# EAGLE design ATTINY85flasher (EAGLE 9.5.0)
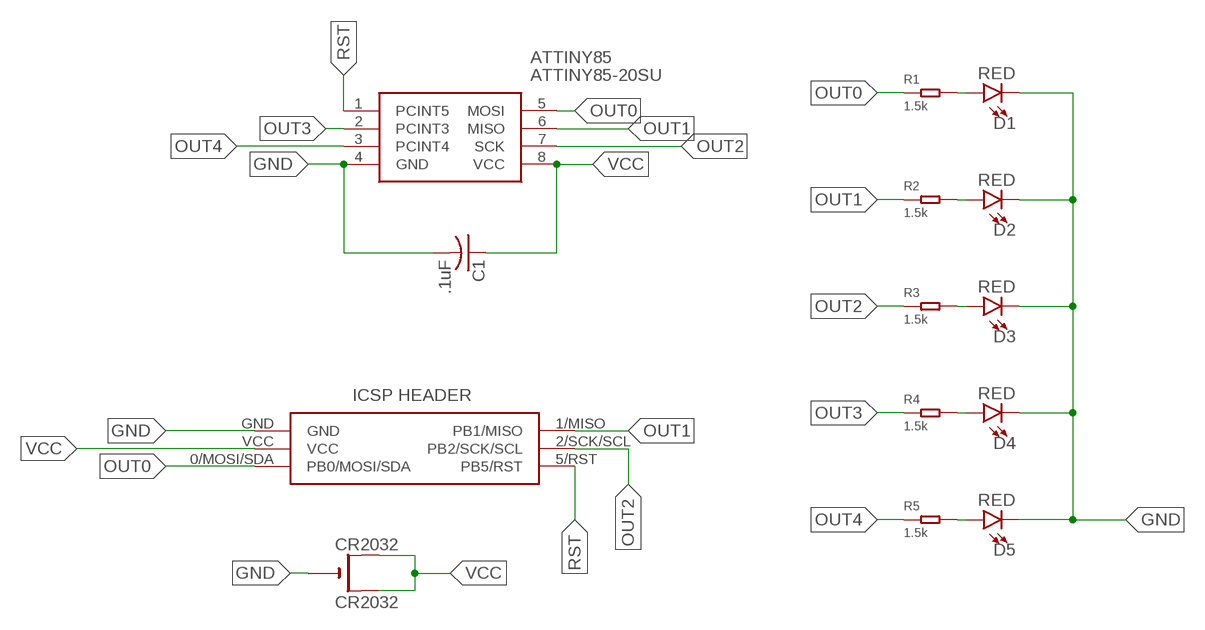
[diagram p0: schematic, sheet 1]

## Parts
ATTINY85  ATTINY85-20SU  [SOT127P798X216-8N]
C1  .1uF  C-USC0603  [C0603]
CR2032  CR2032  CR2032SMT  [CR2032-SMD]
D1  RED  LED-RED1206  [LED-1206]
D2  RED  LED-RED1206  [LED-1206]
D3  RED  LED-RED1206  [LED-1206]
D4  RED  LED-RED1206  [LED-1206]
D5  RED  LED-RED1206  [LED-1206]
J1  ICSP-LO-SILK  [ICSP-LO-SILK]
R1  1.5k  SMD-RES-13R-5%-1/4W(1206)  [R1206]
R2  1.5k  SMD-RES-13R-5%-1/4W(1206)  [R1206]
R3  1.5k  SMD-RES-13R-5%-1/4W(1206)  [R1206]
R4  1.5k  SMD-RES-13R-5%-1/4W(1206)  [R1206]
R5  1.5k  SMD-RES-13R-5%-1/4W(1206)  [R1206]

## Nets
GND: ATTINY85.4(GND) C1.2 CR2032.- D1.C D2.C D3.C D4.C D5.C J1.GND
N$2: D5.A R5.2
N$3: D4.A R4.2
N$4: D3.A R3.2
N$5: D2.A R2.2
N$6: D1.A R1.2
OUT0: ATTINY85.5(MOSI) J1.0/MOSI/SDA(PB0/MOSI/SDA) R1.1
OUT1: ATTINY85.6(MISO) J1.1/MISO(PB1/MISO) R2.1
OUT2: ATTINY85.7(SCK) J1.2/SCK/SCL(PB2/SCK/SCL) R3.1
OUT3: ATTINY85.2(PCINT3) R4.1
OUT4: ATTINY85.3(PCINT4) R5.1
RST: ATTINY85.1(PCINT5) J1.5/RST(PB5/RST)
VCC: ATTINY85.8(VCC) C1.1 CR2032.+$1(+) CR2032.+$2(+1) J1.VCC

## Library data of the parts
ATTINY85 = NickParts:ATTINY85-20SU: MICROCHIP - ATTINY85-20SU - MICROCONTROLLER MCU, 8 BIT, ATTINY, 20MHZ, SOIC-8 Source: Datasheet <https://componentsearchengine.com/Datasheets/2/ATTINY85-20SU.pdf>; ARROW_PART_NUMBER: ATTINY85-20SU; ARROW_PRICE/STOCK: https://www.arrow.com/en/products/attiny85-20su/microchip-technology; DESCRIPTION: MICROCHIP - ATTINY85-20SU - MICROCONTROLLER MCU, 8 BIT, ATTINY, 20MHZ, SOIC-8; HEIGHT: 2.16mm; MANUFACTURER_NAME: Microchip; MANUFACTURER_PART_NUMBER: ATTINY85-20SU; RS_PART_NUMBER: 1331674; RS_PRICE/STOCK: http://uk.rs-online.com/web/p/products/1331674
C1 = adafruit:C-US: CAPACITOR, American symbol
CR2032 = adafruit:CR2032
D1-D5 = SparkFun-LED:LED-RED: Red SMD LED Used in manufacturing of most products at SparkFun Packages: 0603 - SMD 0603 package [Product Link] <http://docs.avagotech.com/docs/AV02-0551EN> 0603 SMART - SMD 0603 SMART package ( more efficient and expensive)[Product Link] <http://www.osram-os.com/Graphics/XPic2/00077099_0.pdf> 1206 - SMD1206 package [Product Link] <https://www.sparkfun.com/datasheets/DevTools/LilyPad/Q150OVS4.pdff> SparkFun Products: Pro Mini 328 -5V <https://www.sparkfun.com/products/821> RedBoard <https://www.sparkfun.com/products/12757> IOIO-OTG <https://www.sparkfun.com/products/13613>; PROD_ID: DIO-09912
J1 = BadgeParts:ICSP-LO-SILK: 03+03 DIL Vertical Pin Header HARWIN M20 Series, 2.54mm Pitch 6 Way 2 Row Straight PCB Header, Solder Termination, 3A Source: Datasheet <https://cdn.harwin.com/pdfs/M20-998.pdf?utm_source=3D_PDF&utm_medium=3D_PDF&utm_campaign=3D_PDF>
R1-R5 = Seeed-Resistor:SMD-RES-13R-5%-1/4W(1206): 301010405; MPN: RC1206JR-0713RL; VALUE: 13R

## Board
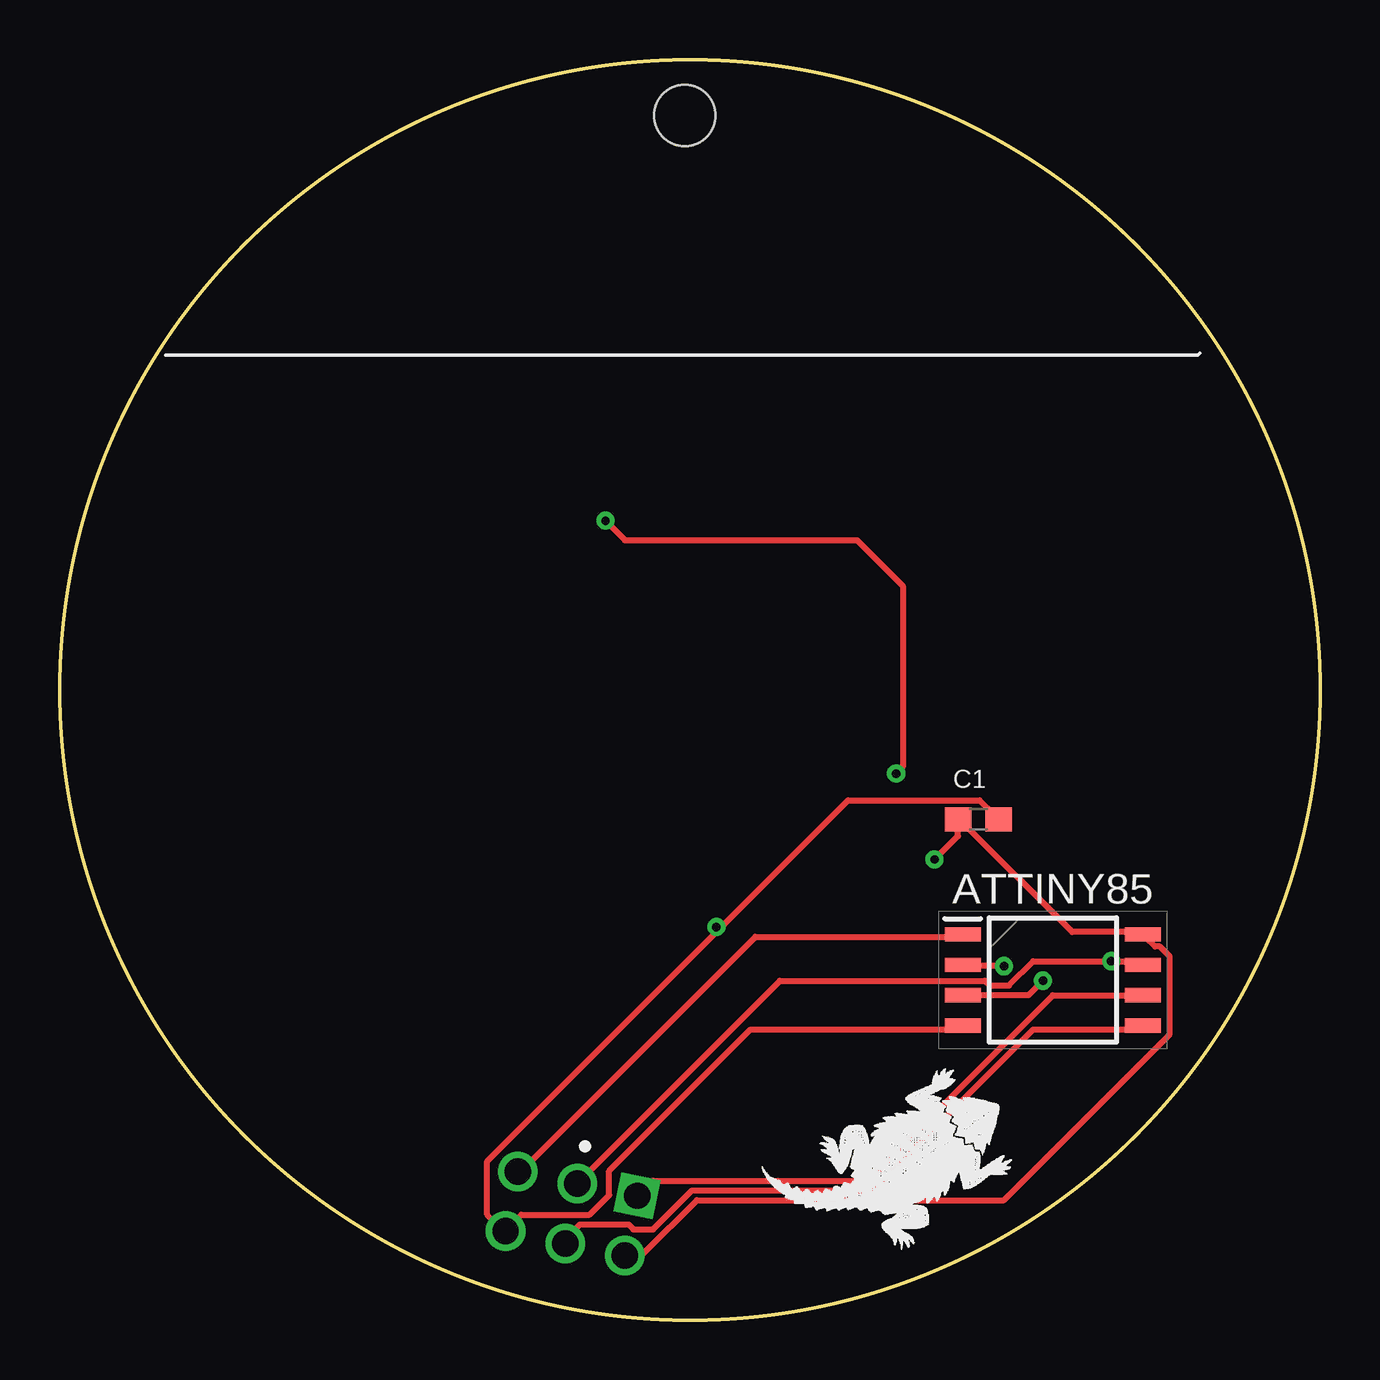
[diagram p1: board, top side]
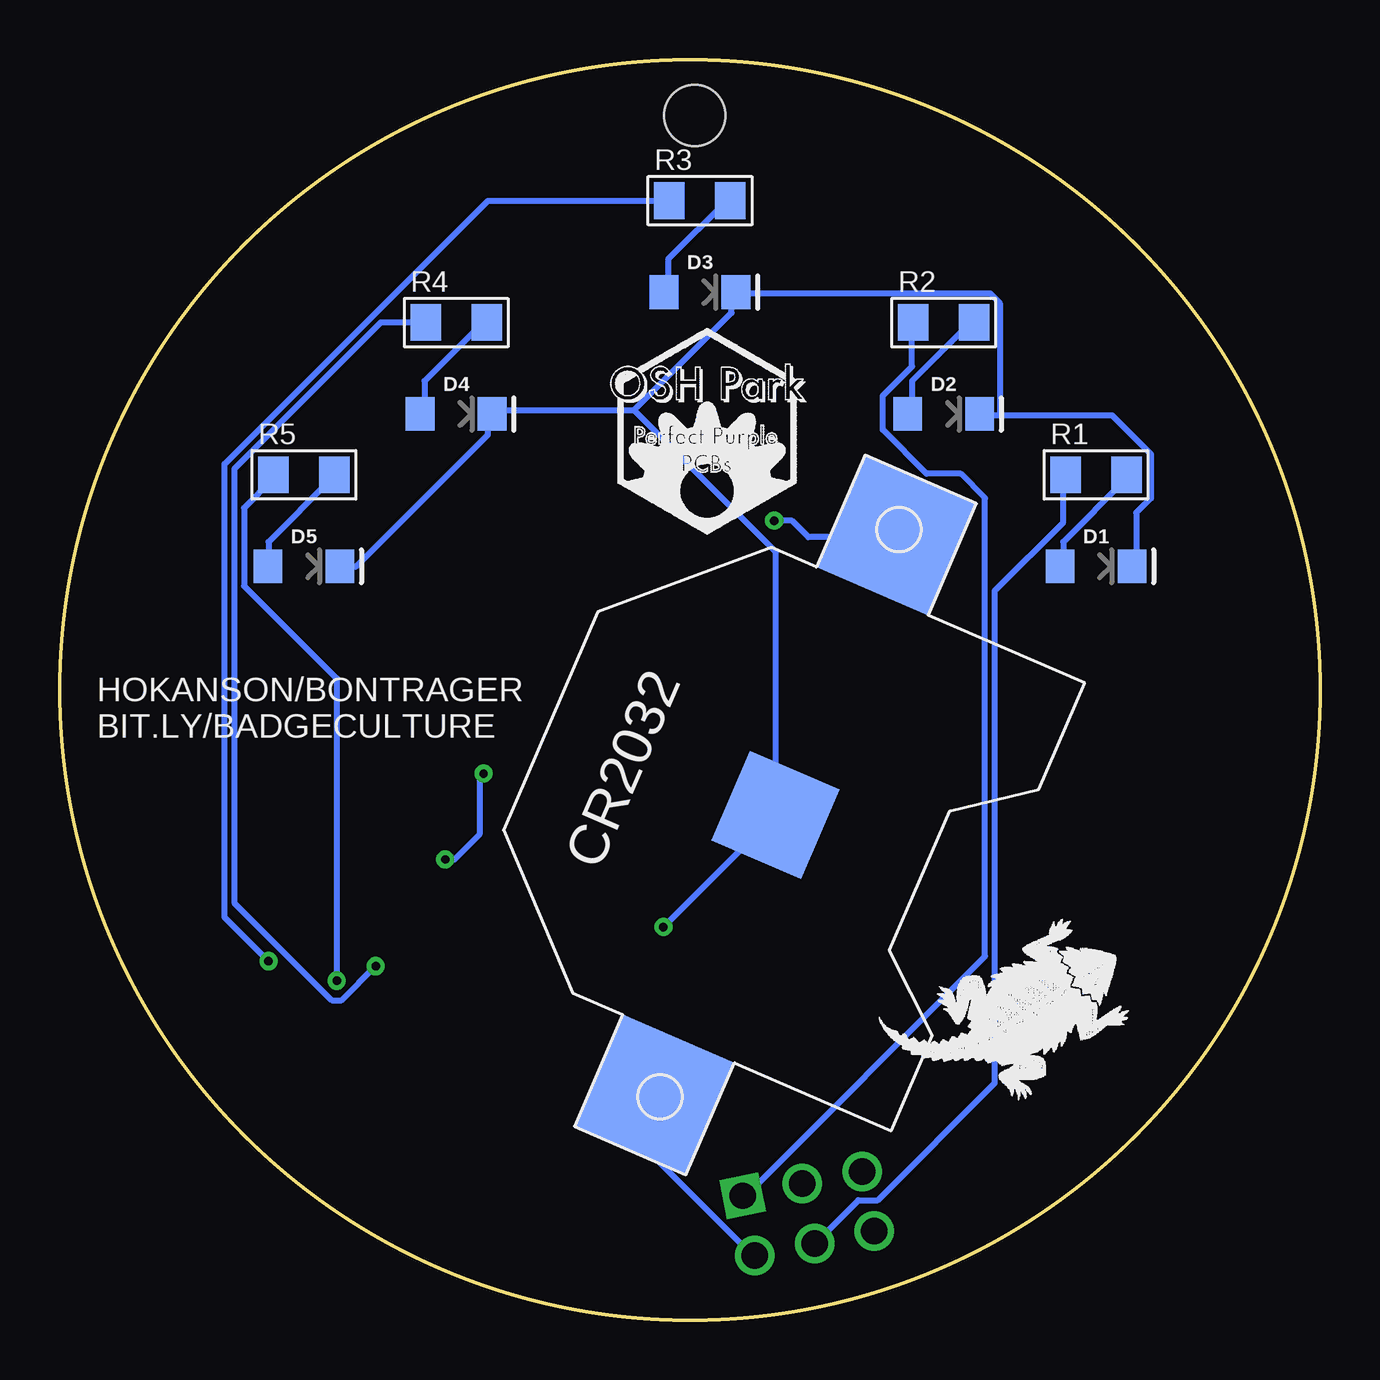
[diagram p2: board, bottom side, seen from below]

Size 52.51 x 52.51 mm. Coordinates in mm from the lower left corner, seen from the top.
Outline: circle at 26.26,26.26 radius 26.26
Copper layers (1*16): Top 0.035mm / dielectric 1.5mm / Bottom 0.035mm
Design rules "default *": minimum track width 10mil, minimum drill 0.35mm, track to track 6mil, track to pad 6mil, pad to pad 6mil, via to via 6mil, smd to smd 6mil, copper to edge 40mil, drill to drill 6mil, minimum pad ring 10mil, minimum via ring 8mil, stop-mask expansion 4mil, vias tented up to drill 0mil, thermal gap 10mil
Holes 2.54 mm at 26.05,50.2
tRestrict: area 8.1,30.1 to 10.6,32.7; area 14.4,36.5 to 16.9,39; area 24.6,41.6 to 27.1,44.1; area 34.7,36.5 to 37.3,39; area 41.1,30.1 to 43.6,32.7
bRestrict: area 8.4,30.4 to 10.2,32.4; area 14.8,36.7 to 16.6,38.8; area 24.9,41.8 to 26.7,43.9; area 35.1,36.7 to 36.9,38.8; area 41.5,30.4 to 43.2,32.4

### Footprints (pad centres in the part's own frame; a part is rotated, then mirrored left to right if it is on the bottom)
SOT127P798X216-8N = smd 1.5 x 0.6: 1 -3.75,1.905; 2 -3.75,0.635; 3 -3.75,-0.635; 4 -3.75,-1.905; 5 3.75,-1.905; 6 3.75,-0.635; 7 3.75,0.635; 8 3.75,1.905
C0603 = smd 1.1 x 1: 1 -0.85,0; 2 0.85,0
CR2032-SMD = smd 5.08 x 5.08: +$1 -12.7,0; +$2 12.7,0 | smd 4.064 x 4.064: - 0,0
LED-1206 = smd 1.2 x 1.4: A -1.5,0; C 1.5,0
ICSP-LO-SILK = drill 1.1 pad 1.65: 0/MOSI/SDA 0,1.27; 2/SCK/SCL 0,3.81; 5/RST -2.54,3.81; GND -2.54,1.27; VCC 2.54,1.27 | drill 1.1 pad 1.65 square: 1/MISO 2.54,3.81
R1206 = smd 1.27 x 1.524: 1 -1.27,0; 2 1.27,0

### Placement (x,y rotation side)
ATTINY85  41.38,14.16 0 top
C1  38.28,20.86 0 top
CR2032  22.69,21.04 246.6 bottom
D1  9.33,31.41 0 bottom
D2  15.68,37.76 0 bottom
D3  25.84,42.84 0 bottom
D4  36,37.76 0 bottom
D5  42.35,31.41 0 bottom
J1  20.81,1.94 348.5 top
R1  9.33,35.22 0 bottom
R2  15.68,41.57 0 bottom
R3  25.84,46.65 0 bottom
R4  36,41.57 0 bottom
R5  42.35,35.22 0 bottom
U$1  [OSHPARK_LOGOHEX]  29.65,32.68 0 bottom
U$2  [HORNEDFROG]  18.9,8.72 0 bottom
U$3  [HORNEDFROG]  28.73,2.5 0 top

### Tracks (layer width: path | path; a pad name or v marks a point on that pad's centre or on a via)
GND  (via drill 0.35)
  Top 0.254: 27.36,16.17 17.81,6.62 17.81,4.38 18.42,3.77 J1.GND 18.62,3.77 19.23,4.38 22.08,4.38 22.89,5.19 22.89,6.21 28.78,12.1 37.52,12.1 ATTINY85.4 | 27.36,16.17 32.85,21.65 38.33,21.65 38.94,21.04 C1.2 | v27.36,16.37 27.36,16.17
  Bottom 0.254: 13.34,37.7 14.15,37.7 D2.C | 13.34,37.7 8.67,37.7 7.04,36.08 7.04,34.25 7.65,33.64 7.65,31.41 D1.C | D5.C 40.16,31.41 34.68,36.89 34.68,37.7 D4.C 34.47,37.91 28.58,37.91 | 28.58,37.91 24.52,41.97 24.52,42.78 D3.C 24.31,42.78 13.75,42.78 13.34,42.38 13.34,37.7 | 28.58,37.91 22.69,32.02 CR2032.- v27.36,16.37
N$2
  Bottom 0.254: D5.A 43.82,31.41 43.82,32.42 41.18,35.06 R5.2
N$3
  Bottom 0.254: D4.A 37.32,37.91 37.32,39.13 34.88,41.57 R4.2
N$4
  Bottom 0.254: D3.A 27.16,42.99 27.16,44.21 24.72,46.65 R3.2
N$5
  Bottom 0.254: D2.A 17,37.91 17,39.13 14.56,41.57 R2.2
N$6
  Bottom 0.254: D1.A 10.7,31.41 10.7,32.42 8.06,35.06 R1.2
OUT0
  Top 0.254: ATTINY85.5 45.04,12.1 40.57,12.1 33.86,5.4 26.34,5.4 24.72,3.77 23.91,3.77 23.7,3.97 21.67,3.97 21.06,3.36 J1.0/MOSI/SDA
  Bottom 0.254: R1.1 10.7,35.06 10.7,33.23 13.54,30.39 13.54,9.87 18.42,4.99 19.23,4.99 20.86,3.36 J1.0/MOSI/SDA
OUT1
  Top 0.254: ATTINY85.6 41.38,13.52 33.66,5.8 24.72,5.8 24.11,5.19 J1.1/MISO
  Bottom 0.254: R2.1 17,41.57 17,39.74 18.22,38.52 18.22,37.1 16.39,35.27 14.97,35.27 13.95,34.25 13.95,15.15 23.91,5.19 J1.1/MISO
OUT2  (via drill 0.35)
  Top 0.254: ATTINY85.7 45.04,14.95 v43.82,14.95 40.57,14.95 39.55,13.93 38.74,13.93 38.54,14.13 30,14.13 21.67,5.8 J1.2/SCK/SCL
  Bottom 0.254: R3.1 34.68,46.65 45.65,35.67 45.65,16.78 v43.82,14.95
OUT3  (via drill 0.35)
  Top 0.254: v39.35,14.74 37.72,14.74 ATTINY85.2
  Bottom 0.254: v39.35,14.74 40.77,13.32 41.18,13.32 45.24,17.38 45.24,35.47 39.15,41.57 R4.1
OUT4  (via drill 0.35)
  Top 0.254: ATTINY85.3 40.37,13.52 v40.97,14.13
  Bottom 0.254: v40.97,14.13 40.97,26.73 44.84,30.59 44.84,33.84 43.62,35.06 R5.1
RST
  Top 0.254: ATTINY85.1 37.52,15.96 28.99,15.96 19.23,6.21 J1.5/RST
VCC  (via drill 0.35)
  Top 0.254: J1.VCC 23.7,2.75 24.31,2.75 26.55,4.99 39.35,4.99 46.26,11.9 46.26,15.15 45.85,15.56 45.65,15.56 45.24,15.96 ATTINY85.8 45.04,16.17 42.19,16.17 37.52,20.84 C1.1 37.43,20.17 v36.45,19.19 | v22.74,33.31 23.55,32.5 33.23,32.5 35.13,30.59 35.13,23.05 v34.85,22.77
  Bottom 0.254: J1.VCC 23.7,2.75 27.56,6.62 27.56,9.26 CR2032.+$2 27.56,9.46 | CR2032.+$1 17.81,32.62 21.32,32.62 22,33.31 v22.74,33.31 | v34.85,22.77 35.03,22.59 35.03,20.23 36.07,19.19 v36.45,19.19

### Text on the board
bPlace: HOKANSON/BONTRAGER / BIT.LY/BADGECULTURE